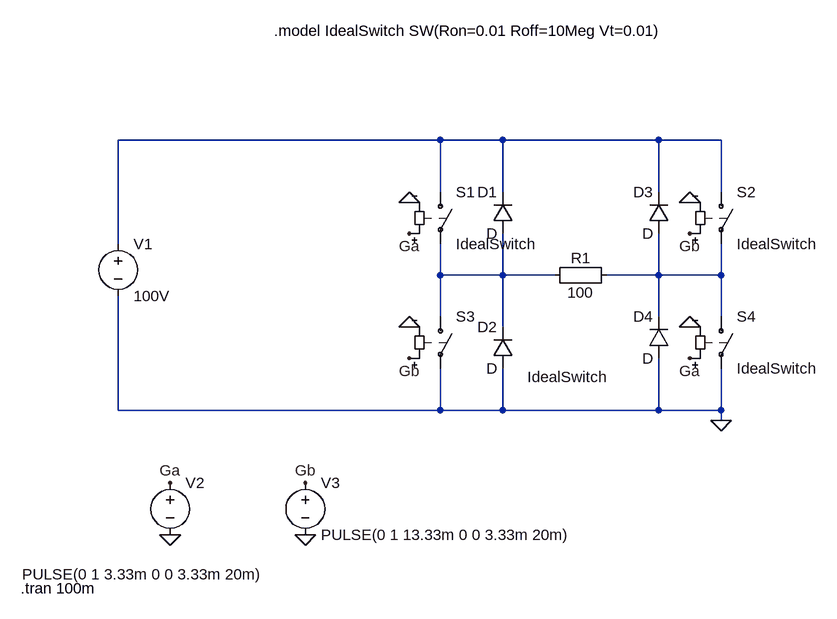
[diagram p0: schematic Single Phase Quasi Square Wave Inverter.asc]
Single Phase Quasi Square Wave Inverter.asc, the LTspice schematic file:
Version 4
SHEET 1 880 724
WIRE 160 16 -336 16
WIRE 256 16 160 16
WIRE 496 16 256 16
WIRE 592 16 496 16
WIRE 160 96 160 16
WIRE 256 96 256 16
WIRE 496 96 496 16
WIRE 592 96 592 16
WIRE -336 176 -336 16
WIRE 160 224 160 176
WIRE 256 224 256 160
WIRE 256 224 160 224
WIRE 336 224 256 224
WIRE 496 224 496 160
WIRE 496 224 416 224
WIRE 592 224 592 176
WIRE 592 224 496 224
WIRE 160 288 160 224
WIRE 496 288 496 224
WIRE 592 288 592 224
WIRE 256 304 256 224
WIRE -336 432 -336 256
WIRE 160 432 160 368
WIRE 160 432 -336 432
WIRE 256 432 256 368
WIRE 256 432 160 432
WIRE 496 432 496 352
WIRE 496 432 256 432
WIRE 592 432 592 368
WIRE 592 432 496 432
WIRE 592 448 592 432
FLAG 544 112 0
FLAG 544 304 0
FLAG 112 112 0
FLAG 112 304 0
FLAG 112 160 Ga
FLAG 544 352 Ga
FLAG 544 160 Gb
FLAG 112 352 Gb
FLAG -256 624 0
FLAG -48 624 0
FLAG -256 544 Ga
FLAG -48 544 Gb
FLAG 592 448 0
SYMBOL sw 160 80 R0
SYMATTR InstName S1
SYMATTR Value IdealSwitch
SYMBOL sw 592 80 R0
SYMATTR InstName S2
SYMATTR Value IdealSwitch
SYMBOL sw 160 272 R0
WINDOW 3 134 109 Left 2
SYMATTR InstName S3
SYMATTR Value IdealSwitch
SYMBOL sw 592 272 R0
SYMATTR InstName S4
SYMATTR Value IdealSwitch
SYMBOL diode 272 160 R180
WINDOW 0 24 64 Left 2
WINDOW 3 24 0 Left 2
SYMATTR InstName D1
SYMBOL diode 272 368 R180
WINDOW 0 24 64 Left 2
WINDOW 3 24 0 Left 2
SYMATTR InstName D2
SYMBOL diode 512 160 R180
WINDOW 0 24 64 Left 2
WINDOW 3 24 0 Left 2
SYMATTR InstName D3
SYMBOL diode 512 352 R180
WINDOW 0 24 64 Left 2
WINDOW 3 24 0 Left 2
SYMATTR InstName D4
SYMBOL Misc\\EuropeanResistor 432 208 R90
WINDOW 0 5 56 VBottom 2
WINDOW 3 27 56 VTop 2
SYMATTR InstName R1
SYMATTR Value 100
SYMBOL voltage -336 160 R0
WINDOW 123 0 0 Left 2
WINDOW 39 0 0 Left 2
SYMATTR InstName V1
SYMATTR Value 100V
SYMBOL voltage -256 528 R0
WINDOW 3 -228 157 Left 2
WINDOW 123 0 0 Left 2
WINDOW 39 0 0 Left 2
SYMATTR InstName V2
SYMATTR Value PULSE(0 1 3.33m 0 0 3.33m 20m)
SYMBOL voltage -48 528 R0
WINDOW 123 0 0 Left 2
WINDOW 39 0 0 Left 2
SYMATTR InstName V3
SYMATTR Value PULSE(0 1 13.33m 0 0 3.33m 20m)
TEXT -486 706 Left 2 !.tran 100m
TEXT -96 -152 Left 2 !.model IdealSwitch SW(Ron=0.01 Roff=10Meg Vt=0.01)

The netlist it stands for:
* Single Phase Quasi Square Wave Inverter.asc
S1 N001 N002 Ga 0 IdealSwitch
S2 N001 N003 Gb 0 IdealSwitch
S3 N002 0 Gb 0 IdealSwitch
S4 N003 0 Ga 0 IdealSwitch
D1 N002 N001 D
D2 0 N002 D
D3 N003 N001 D
D4 0 N003 D
R1 N003 N002 100
V1 N001 0 100V
V2 Ga 0 PULSE(0 1 3.33m 0 0 3.33m 20m)
V3 Gb 0 PULSE(0 1 13.33m 0 0 3.33m 20m)
.model D D
.lib standard.dio
.tran 100m
.model IdealSwitch SW(Ron=0.01 Roff=10Meg Vt=0.01)
.backanno
.end